# EAGLE schematic przod (EAGLE 6.1)
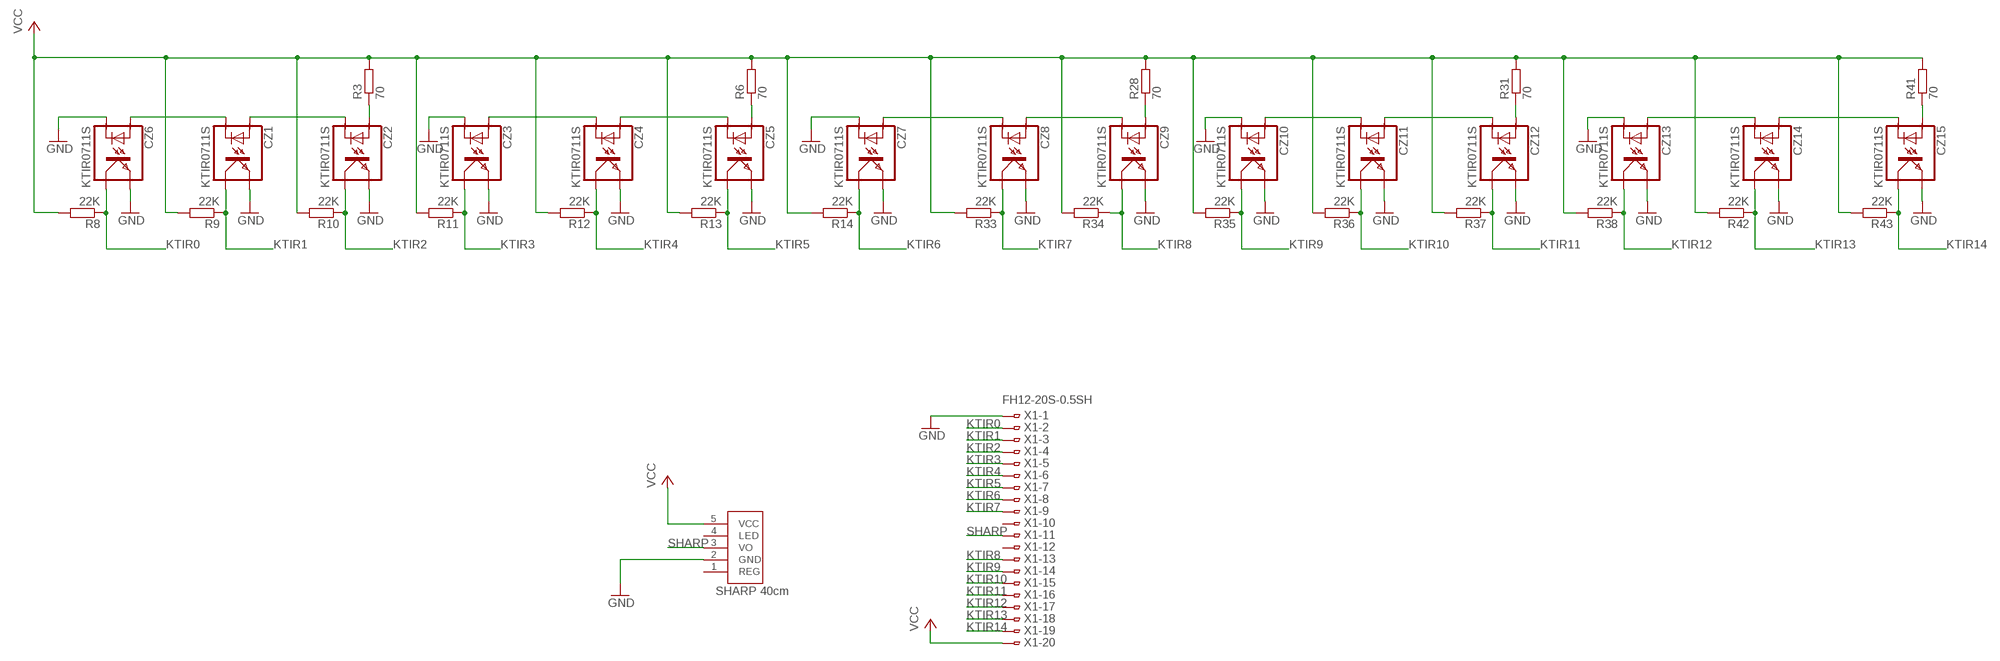
[diagram p0: schematic, sheet 1]

## Parts
CZ1  KTIR0711S  [TOP]
CZ2  KTIR0711S  [TOP]
CZ3  KTIR0711S  [TOP]
CZ4  KTIR0711S  [TOP]
CZ5  KTIR0711S  [TOP]
CZ6  KTIR0711S  [TOP]
CZ7  KTIR0711S  [TOP]
CZ8  KTIR0711S  [TOP]
CZ9  KTIR0711S  [TOP]
CZ10  KTIR0711S  [TOP]
CZ11  KTIR0711S  [TOP]
CZ12  KTIR0711S  [TOP]
CZ13  KTIR0711S  [TOP]
CZ14  KTIR0711S  [TOP]
CZ15  KTIR0711S  [TOP]
R3  70  R-EU_R0805  [R0805]
R6  70  R-EU_R0805  [R0805]
R8  22K  R-EU_R0805  [R0805]
R9  22K  R-EU_R0805  [R0805]
R10  22K  R-EU_R0805  [R0805]
R11  22K  R-EU_R0805  [R0805]
R12  22K  R-EU_R0805  [R0805]
R13  22K  R-EU_R0805  [R0805]
R14  22K  R-EU_R0805  [R0805]
R28  70  R-EU_R0805  [R0805]
R31  70  R-EU_R0805  [R0805]
R33  22K  R-EU_R0805  [R0805]
R34  22K  R-EU_R0805  [R0805]
R35  22K  R-EU_R0805  [R0805]
R36  22K  R-EU_R0805  [R0805]
R37  22K  R-EU_R0805  [R0805]
R38  22K  R-EU_R0805  [R0805]
R41  70  R-EU_R0805  [R0805]
R42  22K  R-EU_R0805  [R0805]
R43  22K  R-EU_R0805  [R0805]
U$1  GP2Y0D340K  [GP2Y0D340K]
X1  FH12-20S-0.5SH  [FH12-20S-0.5SH]

## Nets
GND: CZ1.EMITER CZ2.EMITER CZ3.EMITER CZ3.KATODA CZ4.EMITER CZ5.EMITER CZ6.EMITER CZ6.KATODA CZ7.EMITER CZ7.KATODA CZ8.EMITER CZ9.EMITER CZ10.EMITER CZ10.KATODA CZ11.EMITER CZ12.EMITER CZ13.EMITER CZ13.KATODA CZ14.EMITER CZ15.EMITER U$1.2(GND) X1.1
KTIR0: CZ6.KOLEKTOR R8.1 X1.2
KTIR1: CZ1.KOLEKTOR R9.1 X1.3
KTIR2: CZ2.KOLEKTOR R10.1 X1.4
KTIR3: CZ3.KOLEKTOR R11.1 X1.5
KTIR4: CZ4.KOLEKTOR R12.1 X1.6
KTIR5: CZ5.KOLEKTOR R13.1 X1.7
KTIR6: CZ7.KOLEKTOR R14.1 X1.8
KTIR7: CZ8.KOLEKTOR R33.1 X1.9
KTIR8: CZ9.KOLEKTOR R34.1 X1.13
KTIR9: CZ10.KOLEKTOR R35.1 X1.14
KTIR10: CZ11.KOLEKTOR R36.1 X1.15
KTIR11: CZ12.KOLEKTOR R37.1 X1.16
KTIR12: CZ13.KOLEKTOR R38.1 X1.17
KTIR13: CZ14.KOLEKTOR R42.1 X1.18
KTIR14: CZ15.KOLEKTOR R43.1 X1.19
N$2: CZ7.ANODA CZ8.KATODA
N$3: CZ5.ANODA R6.1
N$5: CZ4.ANODA CZ5.KATODA
N$7: CZ3.ANODA CZ4.KATODA
N$9: CZ2.ANODA R3.1
N$10: CZ1.ANODA CZ2.KATODA
N$11: CZ1.KATODA CZ6.ANODA
N$12: CZ8.ANODA CZ9.KATODA
N$13: CZ10.ANODA CZ11.KATODA
N$14: CZ11.ANODA CZ12.KATODA
N$15: CZ13.ANODA CZ14.KATODA
N$16: CZ14.ANODA CZ15.KATODA
N$24: CZ12.ANODA R31.1
N$27: CZ9.ANODA R28.1
N$36: CZ15.ANODA R41.1
SHARP: U$1.3(VO) X1.11
VCC: R3.2 R6.2 R8.2 R9.2 R10.2 R11.2 R12.2 R13.2 R14.2 R28.2 R31.2 R33.2 R34.2 R35.2 R36.2 R37.2 R38.2 R41.2 R42.2 R43.2 U$1.5(VCC) X1.20
Unconnected: U$1.1(REG) U$1.4(LED) X1.10 X1.12

## Library data of the parts
CZ1-CZ15 = KTIR0711S:KTIR0711S
R3 R6 R8-R14 R28 R31 R33-R38 R41-R43 = rcl:R-EU_: RESISTOR, European symbol
U$1 = GP2Y0D340K:GP2Y0D340K
X1 = con-hirose:FH12-20S-0.5S: 0.5mm Pitch Connectors For FPC/FFC Source: Data sheet <http://www.hirose.co.jp/cataloge_hp/e58605370.pdf>; MPN: FH12-20S-0.5SH(55); OC_FARNELL: 1324549; OC_NEWARK: 34M6166